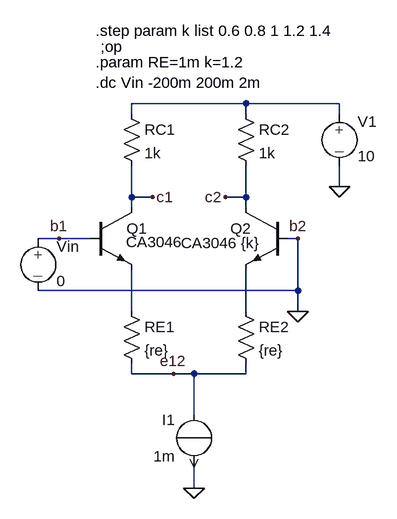
[diagram p0: schematic diff-unsymm.asc]
diff-unsymm.asc, the LTspice schematic file:
Version 4
SHEET 1 1252 680
WIRE 368 -48 192 -48
WIRE 512 -48 368 -48
WIRE 192 -32 192 -48
WIRE 368 -32 368 -48
WIRE 512 -32 512 -48
WIRE 512 80 512 48
WIRE 192 96 192 48
WIRE 224 96 192 96
WIRE 368 96 368 48
WIRE 368 96 336 96
WIRE 192 112 192 96
WIRE 368 112 368 96
WIRE 80 160 48 160
WIRE 128 160 80 160
WIRE 448 160 432 160
WIRE 448 240 448 160
WIRE 448 240 48 240
WIRE 192 272 192 208
WIRE 368 272 368 208
WIRE 448 272 448 240
WIRE 192 368 192 352
WIRE 256 368 192 368
WIRE 288 368 256 368
WIRE 368 368 368 352
WIRE 368 368 288 368
WIRE 288 432 288 368
WIRE 288 544 288 512
FLAG 288 544 0
FLAG 512 80 0
FLAG 224 96 c1
FLAG 336 96 c2
FLAG 80 160 b1
FLAG 448 160 b2
FLAG 256 368 e12
FLAG 448 272 0
SYMBOL EIT_Semiconductors\\npn 128 112 R0
WINDOW 3 55 53 Left 2
SYMATTR Value CA3046
SYMATTR InstName Q1
SYMBOL EIT_Semiconductors\\npn 432 112 M0
WINDOW 3 42 55 Left 2
SYMATTR Value CA3046 {k}
SYMATTR InstName Q2
SYMBOL source-I 288 512 R180
WINDOW 0 29 73 Left 2
WINDOW 3 29 17 Left 2
SYMATTR InstName I1
SYMATTR Value 1m
SYMBOL source-V 48 144 R0
SYMATTR InstName Vin
SYMATTR Value 0
SYMBOL res 176 -48 R0
SYMATTR InstName RC1
SYMATTR Value 1k
SYMBOL res 352 -48 R0
SYMATTR InstName RC2
SYMATTR Value 1k
SYMBOL source-V 512 -48 R0
SYMATTR InstName V1
SYMATTR Value 10
SYMBOL res 176 256 R0
SYMATTR InstName RE1
SYMATTR Value {re}
SYMBOL res 352 256 R0
SYMATTR InstName RE2
SYMATTR Value {re}
TEXT 144 -136 Left 2 !;op
TEXT 136 -80 Left 2 !.dc Vin -200m 200m 2m
TEXT 136 -112 Left 2 !.param RE=1m k=1.2
TEXT 136 -160 Left 2 !.step param k list 0.6 0.8 1 1.2 1.4

The netlist it stands for:
* diff-unsymm.asc
Q1 c1 b1 N002 0 CA3046
Q2 c2 0 N003 0 CA3046 {k}
I1 e12 0 1m
Vin b1 0 0
RC1 N001 c1 1k
RC2 N001 c2 1k
V1 N001 0 10
RE1 N002 e12 {re}
RE2 N003 e12 {re}
.model NPN NPN
.model PNP PNP
.lib standard.bjt
;op
.dc Vin -200m 200m 2m
.param RE=1m k=1.2
.step param k list 0.6 0.8 1 1.2 1.4
.backanno
.end